# Altium project Course_7_DC-DC.PrjPcb
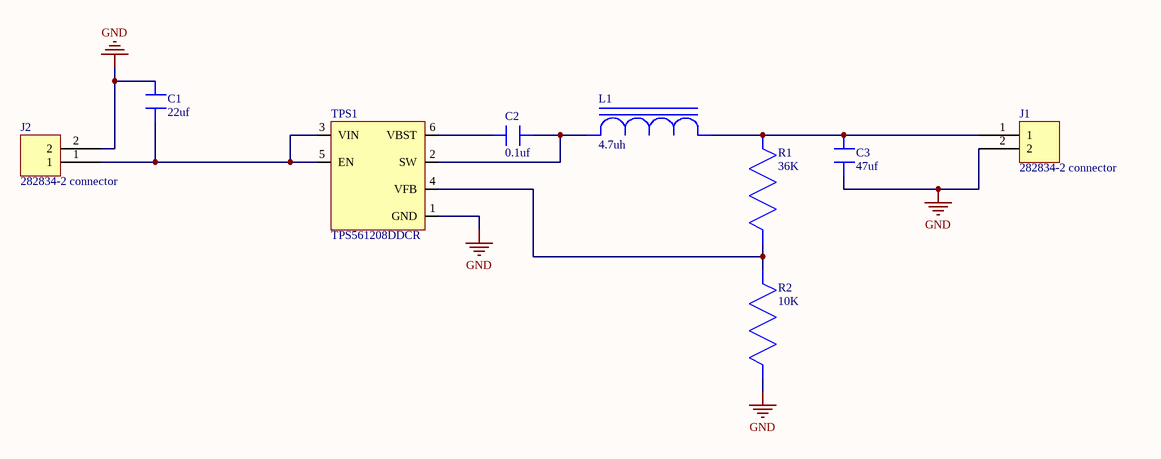
[diagram p0: Sheet1.SchDoc]
1 sheet, 9 parts. Net scope: global (net labels, ports and power ports of the same name join across sheets).
Board file: PCB1.PcbDoc

## Sheet Sheet1.SchDoc
size A; SheetNumber: 1; SheetTotal: 1

### Parts
C1  22uf  [Capacitor 22uf 10v]
C2  0.1uf  [Capacitor 0.1uf 10v]
C3  47uf  [Capacitor 47uf]
J1  282834-2 connector  [282834-2]
J2  282834-2 connector  [282834-2]
L1  4.7uh  [Inductor 4.7uh 1a]
R1  36K  [Resistor 36K]
R2  10K  [Resistor 10k]
TPS1  TPS561208DDCR  [TPS]

### Nets
GND: C1.2 C3.1 J1.2 J2.2 R2.1 TPS1.1(GND)
NetC1_1: C1.1 J2.1 TPS1.3(VIN) TPS1.5(EN)
NetC2_1: C2.1 TPS1.6(VBST)
NetC2_2: C2.2 L1.1 TPS1.2(SW)
NetC3_2: C3.2 J1.1 L1.2 R1.2
NetR1_1: R1.1 R2.2 TPS1.4(VFB)

### Library data of the parts
C1 = CL10A226MP8ZUNE: Manufacturer: Samsung; Supplier: Digikey; Supplier Part Number: 1276-CL10A226MP8ZUNETR-ND; Manufacturer Part Number: CL10A226MP8ZUNE; RoHS: Yes; Category: Ceramic Capacitors; Pricing: 300000=0.04242 (USD)
C2 = CL05A104KP5NNNC: Multilayer Ceramic Capacitor, 0.1 uF, 10 V, ± 10%, X5R, 0402 [1005 Metric]; Manufacturer: Samsung; Material: 4241ConductorMaterial; Value: 100nF; Voltage Rating: 10V; Supplier: Avnet; Supplier Part Number: CL05A104KP5NNNC; Manufacturer Part Number: CL05A104KP5NNNC; RoHS: Yes; Category: Ceramic Capacitors; Stock: 2160000; Pricing: 10000=0.00207 (USD); Mounting Technology: Surface Mount; Case/Package: 0402; Case Code (Metric): 1005; Case Code (Imperial): 0402; Min Operating Temperature: -55°C; Max Operating Temperature: 85°C; Tolerance: 10%; Packaging: Tape and Reel; Dielectric: X5R; Series: CL; Construction: Flat; Voltage Rating (DC): 10V; Length: 1mm; Width: 0.02inch; Height: 0.5mm; Thickness: 0.022inch; Depth: 0.5mm; Radiation Hardening: No; RoHS Compliant: Yes; ComponentLink1URL: https://datasheet.ciiva.com/25709/cl05a104kp5nnnc-25709120.pdf?src-supplier=Digikey; ComponentLink1Description: https://datasheet.ciiva.com/25709/cl05a104kp5nnnc-25709120.pdf?src-supplier=Digikey; ComponentLink2URL: https://datasheet.ciiva.com/26838/getdatasheetpartid-358611-26838151.pdf?src-supplier=Verical; ComponentLink2Description: https://datasheet.ciiva.com/26838/getdatasheetpartid-358611-26838151.pdf?src-supplier=Verical; ComponentLink3URL: https://datasheet.ciiva.com/16437/cl05b104kq5nnnc-16437370.pdf?src-supplier=Future+Electronics; ComponentLink3Description: https://datasheet.ciiva.com/16437/cl05b104kq5nnnc-16437370.pdf?src-supplier=Future+Electronics; ComponentLink4URL: https://datasheet.ciiva.com/26309/mlcc-catalogdownload2013-eng-26309007.pdf?src-supplier=Distrelec; ComponentLink4Description: https://datasheet.ciiva.com/26309/mlcc-catalogdownload2013-eng-26309007.pdf?src-supplier=Distrelec
C3 = CL31A476MPHNNNE: Cap Ceramic 47uF 10V X5R 20% SMD 1206 85°C Embossed Plastic T/R; Manufacturer: Samsung; Supplier: Avnet; Supplier Part Number: CL31A476MPHNNNE; Manufacturer Part Number: CL31A476MPHNNNE; RoHS: Yes; Category: Ceramic Capacitors; Stock: 102000; Pricing: 2000=0.113, 4000=0.1104, 8000=0.1078, 12000=0.1052, 16000=0.10261 (USD); ComponentLink1URL: https://datasheet.ciiva.com/25723/cl31a476mphnnne-25723732.pdf?src-supplier=Digikey; ComponentLink1Description: https://datasheet.ciiva.com/25723/cl31a476mphnnne-25723732.pdf?src-supplier=Digikey; ComponentLink2URL: https://datasheet.ciiva.com/15216/getdatasheetpartid-467074-15216239.pdf?src-supplier=Verical; ComponentLink2Description: https://datasheet.ciiva.com/15216/getdatasheetpartid-467074-15216239.pdf?src-supplier=Verical; ComponentLink3URL: https://datasheet.ciiva.com/29201/452069-da-01-en-vs-kondensator-1206-29201604.pdf?src-supplier=Conrad; ComponentLink3Description: https://datasheet.ciiva.com/29201/452069-da-01-en-vs-kondensator-1206-29201604.pdf?src-supplier=Conrad
J1 J2 = 282834-2: Conn PC Board Terminal Block Receptacle 2 POS 2.54mm RA Through Hole 10A; Manufacturer: TE Connectivity; Plating: Brass,Steel; Number of Contacts: 2; Max Voltage Rating (AC): 150V; Number of Levels: 1; Interlock: No (Without); Screwless Terminal Block: Yes (With); Gender: Male; Connector System: 5937ConnectorSystem; Wire Gauge (Max): 30AWG; Thread Size: M1.6; Tail Length: 3.4mm; Approvals: UL; Supplier: Rs; Supplier Part Number: 7100104P; Manufacturer Part Number: 282834-2; RoHS: Yes; Category: Terminal Blocks; Stock: 12560; Pricing: 125=0.822, 375=0.692, 1000=0.584, 2000=0.528 (GBP); Mounting Technology: Through Hole; Housing Color: Green; Contact Plating: Tin; Contact Material: Brass; Color: Green; Housing Material: Polyamide; Material: Nylon; Min Operating Temperature: -40°C; Max Operating Temperature: 105°C; Number of Rows: 1; Termination: Solder; Orientation: Straight; Current Rating: 10A; Voltage Rating: 150V; Package Quantity: 300; Packaging: Bulk; Number of Positions: 2; Number of Positions Per Level: 2; Current: 10A; Voltage: 150V; Max Supply Voltage (AC): 150V; Number of Circuits: 2; Connector Type: Receptacle; Max Current Rating: 10A; Screw Flange: No (Without); Side Stackable: Yes (With); Series: Buchanan; Number of Poles: 2; Closed End: No (Without); Operating Supply Voltage: 150V; Length: 5.54mm; Width: 6.5mm; Pitch: 2.54mm; Wire Gauge (Min): 30AWG; Depth: 6.5mm; Wire/Cable Gauge: 30AWG; Radiation Hardening: No; Lead Free: Lead Free; Flammability Rating: UL94 V-0; RoHS Compliant: Yes; Reach SVHC Compliant: Unknown; ComponentLink1URL: https://datasheet.ciiva.com/11758/0900766b80e7dc96-11758675.pdf?src-supplier=Rs; ComponentLink1Description: https://datasheet.ciiva.com/11758/0900766b80e7dc96-11758675.pdf?src-supplier=Rs; ComponentLink2URL: https://datasheet.ciiva.com/16386/282834-2-16386363.pdf?src-supplier=Future+Electronics; ComponentLink2Description: https://datasheet.ciiva.com/16386/282834-2-16386363.pdf?src-supplier=Future+Electronics; ComponentLink3URL: https://datasheet.ciiva.com/823/eng-cd-282834-c1-823453.pdf?src-supplier=Digikey; ComponentLink3Description: https://datasheet.ciiva.com/823/eng-cd-282834-c1-823453.pdf?src-supplier=Digikey; ComponentLink4URL: https://datasheet.ciiva.com/3141/eng-cs-1308389-eurostyle-terminal-blocks-0607-3141115.pdf?src-supplier=Avnet; ComponentLink4Description: https://datasheet.ciiva.com/3141/eng-cs-1308389-eurostyle-terminal-blocks-0607-3141115.pdf?src-supplier=Avnet; ComponentLink5URL: https://datasheet.ciiva.com/15169/getdatasheetpartid-155864-15169558.pdf?src-supplier=Verical; ComponentLink5Description: https://datasheet.ciiva.com/15169/getdatasheetpartid-155864-15169558.pdf?src-supplier=Verical; ComponentLink6URL: https://datasheet.ciiva.com/30166/eng-cs-1308389-eurostyle-terminal-blocks-0607-30166974.pdf?src-supplier=Onlinecomponents.com; ComponentLink6Description: https://datasheet.ciiva.com/30166/eng-cs-1308389-eurostyle-terminal-blocks-0607-30166974.pdf?src-supplier=Onlinecomponents.com; ComponentLink7URL: https://datasheet.ciiva.com/14609/70086732-14609670.pdf?src-supplier=Allied+Electronics; ComponentLink7Description: https://datasheet.ciiva.com/14609/70086732-14609670.pdf?src-supplier=Allied+Electronics
L1 = BRL3225T4R7M: FIXED IND 4.7UH 1A 216 MOHM SMD; Manufacturer: Taiyo Yuden; Supplier: Avnet; Supplier Part Number: 25R4119; Manufacturer Part Number: BRL3225T4R7M; RoHS: Yes; Category: Fixed Inductors; Stock: 1070; Pricing: 1=0.229, 10=0.159, 25=0.147, 50=0.134, 100=0.122 (USD); ComponentLink1URL: https://datasheet.ciiva.com/15981/8brl3225t4r7m-15981663.pdf?src-supplier=Onlinecomponents.com; ComponentLink1Description: https://datasheet.ciiva.com/15981/8brl3225t4r7m-15981663.pdf?src-supplier=Onlinecomponents.com; ComponentLink2URL: https://datasheet.ciiva.com/7291/brl3225t4r7m-ss-7291489.pdf?src-supplier=Newark; ComponentLink2Description: https://datasheet.ciiva.com/7291/brl3225t4r7m-ss-7291489.pdf?src-supplier=Newark; ComponentLink3URL: https://datasheet.ciiva.com/26871/getdatasheetpartid-638954-26871104.pdf?src-supplier=Verical; ComponentLink3Description: https://datasheet.ciiva.com/26871/getdatasheetpartid-638954-26871104.pdf?src-supplier=Verical; ComponentLink4URL: https://datasheet.ciiva.com/25607/0900766b810b3c54-25607088.pdf?src-supplier=Rs; ComponentLink4Description: https://datasheet.ciiva.com/25607/0900766b810b3c54-25607088.pdf?src-supplier=Rs; ComponentLink5URL: https://datasheet.ciiva.com/1040/wound07-e-1040626.pdf?src-supplier=Digikey; ComponentLink5Description: https://datasheet.ciiva.com/1040/wound07-e-1040626.pdf?src-supplier=Digikey; ComponentLink6URL: https://datasheet.ciiva.com/1040/wound07-e-1040627.pdf?src-supplier=Digikey; ComponentLink6Description: https://datasheet.ciiva.com/1040/wound07-e-1040627.pdf?src-supplier=Digikey; ComponentLink7URL: https://datasheet.ciiva.com/1040/wound07-e-1040628.pdf?src-supplier=Digikey; ComponentLink7Description: https://datasheet.ciiva.com/1040/wound07-e-1040628.pdf?src-supplier=Digikey; ComponentLink8URL: https://datasheet.ciiva.com/8505/wound07-e-8505597.pdf?src-supplier=Avnet; ComponentLink8Description: https://datasheet.ciiva.com/8505/wound07-e-8505597.pdf?src-supplier=Avnet
R1 = CRCW080536K0FKEA: SMD Chip Resistor, 36 kOhm, ± 1%, 125 mW, 0805 [2012 Metric], Thick Film, General Purpose; Manufacturer: Vishay; Value: 36kR; Temperature Coefficient: 100ppm/°C; Max Power Dissipation: 125mW; Voltage Rating: 150V; Supplier: Mouser; Supplier Part Number: 71-CRCW080536K0FKEA; Manufacturer Part Number: CRCW080536K0FKEA; RoHS: Yes; Category: Chip SMD Resistors; Stock: 11437; Pricing: 1=0.1, 10=0.025, 50=0.025, 100=0.015, 1000=0.012, 10000=0.008 (USD); Case/Package: 0805; Pins: 2; Weight: 0.000194oz; Case Code (Imperial): 0805; Case Code (Metric): 2012; Contact Plating: Tin; Min Operating Temperature: -55°C; Max Operating Temperature: 155°C; Tolerance: 1%; Packaging: Tape and Reel; Package Quantity: 5000; Number of Terminations: 2; Features: Automotive AEC-Q200; Series: CRCW; Power Rating: 125mW; Resistor Type: Thick Film; Termination: SMD/SMT; Resistance Tolerance: 1%; Construction: Rectangular; Technology: THICK FILM; Voltage Rating (DC): 150V; Length: 2mm; Width: 1.25mm; Height: 0.45mm; Depth: 1.25mm; Ratings: AEC-Q200; RoHS Compliant: Yes; Lead Free: 5697LeadFree; Military Standard: Not; Reach SVHC Compliant: Unknown; ComponentLink1URL: https://datasheet.ciiva.com/11818/0900766b80d98b26-11818207.pdf?src-supplier=Rs; ComponentLink1Description: https://datasheet.ciiva.com/11818/0900766b80d98b26-11818207.pdf?src-supplier=Rs; ComponentLink2URL: https://datasheet.ciiva.com/7671/1697337-7671691.pdf?src-supplier=Element14; ComponentLink2Description: https://datasheet.ciiva.com/7671/1697337-7671691.pdf?src-supplier=Element14; ComponentLink3URL: https://datasheet.ciiva.com/2496/dcrcwe3-2496185.pdf?src-supplier=Digikey; ComponentLink3Description: https://datasheet.ciiva.com/2496/dcrcwe3-2496185.pdf?src-supplier=Digikey; ComponentLink4URL: https://datasheet.ciiva.com/2496/dcrcwe3-2496186.pdf?src-supplier=Digikey; ComponentLink4Description: https://datasheet.ciiva.com/2496/dcrcwe3-2496186.pdf?src-supplier=Digikey; ComponentLink5URL: https://datasheet.ciiva.com/2496/dcrcwe3-2496184.pdf?src-supplier=Digikey; ComponentLink5Description: https://datasheet.ciiva.com/2496/dcrcwe3-2496184.pdf?src-supplier=Digikey; ComponentLink6URL: https://datasheet.ciiva.com/7725/66915-7725941.pdf?src-supplier=Element14; ComponentLink6Description: https://datasheet.ciiva.com/7725/66915-7725941.pdf?src-supplier=Element14; ComponentLink7URL: https://datasheet.ciiva.com/26314/fld-crcw-e3-data-en-26314581.pdf?src-supplier=Distrelec; ComponentLink7Description: https://datasheet.ciiva.com/26314/fld-crcw-e3-data-en-26314581.pdf?src-supplier=Distrelec; ComponentLink8URL: https://datasheet.ciiva.com/7671/1697337-7671690.pdf?src-supplier=Element14; ComponentLink8Description: https://datasheet.ciiva.com/7671/1697337-7671690.pdf?src-supplier=Element14; ComponentLink9URL: https://datasheet.ciiva.com/22683/1912744-22683321.pdf?src-supplier=Element14; ComponentLink9Description: https://datasheet.ciiva.com/22683/1912744-22683321.pdf?src-supplier=Element14; ComponentLink10URL: https://datasheet.ciiva.com/16396/dcrcwe3-16396283.pdf?src-supplier=Future+Electronics; ComponentLink10Description: https://datasheet.ciiva.com/16396/dcrcwe3-16396283.pdf?src-supplier=Future+Electronics
R2 = CRCW080510K0FKTA: Resistor, Thick Film Chip; 10 K Ohms; Case 0805; 0.125W; +/-1%; SMD; 100ppm/K; 150V; Manufacturer: Vishay Dale; Power Dissipation: 125mW; Supplier: Mouser; Supplier Part Number: 71-CRCW0805-10K; Manufacturer Part Number: CRCW080510K0FKTA; RoHS: No; Category: Chip SMD Resistors; Stock: 197053; Pricing: 1=0.14, 10=0.054, 50=0.054, 100=0.034, 1000=0.023, 10000=0.018 (USD); Pins: 2NUMBER; Voltage Rating (DC): 150V; Lead Free: 5698LeadFree; ComponentLink1URL: https://datasheet.ciiva.com/3883/dcrcw-3883030.pdf?src-supplier=Arrow+Electronics; ComponentLink1Description: https://datasheet.ciiva.com/3883/dcrcw-3883030.pdf?src-supplier=Arrow+Electronics; ComponentLink2URL: https://datasheet.ciiva.com/3258/dcrcw-3258026.pdf?src-supplier=Avnet; ComponentLink2Description: https://datasheet.ciiva.com/3258/dcrcw-3258026.pdf?src-supplier=Avnet; ComponentLink3URL: https://datasheet.ciiva.com/9052/dcrcw-9052662.pdf?src-supplier=Avnet; ComponentLink3Description: https://datasheet.ciiva.com/9052/dcrcw-9052662.pdf?src-supplier=Avnet; ComponentLink4URL: https://datasheet.ciiva.com/2567/dcrcw-2567012.pdf?src-supplier=Digikey; ComponentLink4Description: https://datasheet.ciiva.com/2567/dcrcw-2567012.pdf?src-supplier=Digikey; ComponentLink5URL: https://datasheet.ciiva.com/16498/dcrcw-16498298.pdf?src-supplier=Future+Electronics; ComponentLink5Description: https://datasheet.ciiva.com/16498/dcrcw-16498298.pdf?src-supplier=Future+Electronics
TPS1 = TPS561208DDCR: 4.5V to 17V Input, 1A Output, Synchronous Step-Down Converter 6-SOT-23-THIN -40 to 125; Manufacturer: Texas Instruments; Output Type: Adjustable; Output Configuration: Positive; Number of Outputs: 1; Min Output Voltage: 760mV; Max Output Voltage: 7V; Switching Frequency: 580kHz; Synchronous Rectifier: Yes; Nominal Supply Current: 590uA; Output Voltage: 1.05V; Max Duty Cycle: 75%; Supplier: Mouser; Supplier Part Number: 595-TPS561208DDCR; Manufacturer Part Number: TPS561208DDCR; RoHS: Yes; Category: Voltage Regulators - Switching; Stock: 4365; Pricing: 1=0.6, 10=0.498, 50=0.498, 100=0.377, 1000=0.255, 10000=0.207 (USD); Mounting Technology: Surface Mount; Case/Package: SOT-23-6; Pins: 6NUMBER; Min Operating Temperature: -40°C; Max Operating Temperature: 85°C; Packaging: Cut Tape; Min Input Voltage: 4.5V; Max Supply Voltage: 17V; Output Current: 1A; Series: SWIFT™; Min Supply Voltage: 4.5V; Length: 2.9mm; Width: 1.6mm; Height: 1.1mm; Thickness: 870um; RoHS Compliant: Yes; ComponentLink1URL: http://www.ti.com/lit/ds/symlink/tps561201.pdf?src-supplier=Digikey; ComponentLink1Description: http://www.ti.com/lit/ds/symlink/tps561201.pdf?src-supplier=Digikey